# EAGLE design v1 (EAGLE 7.7.0)
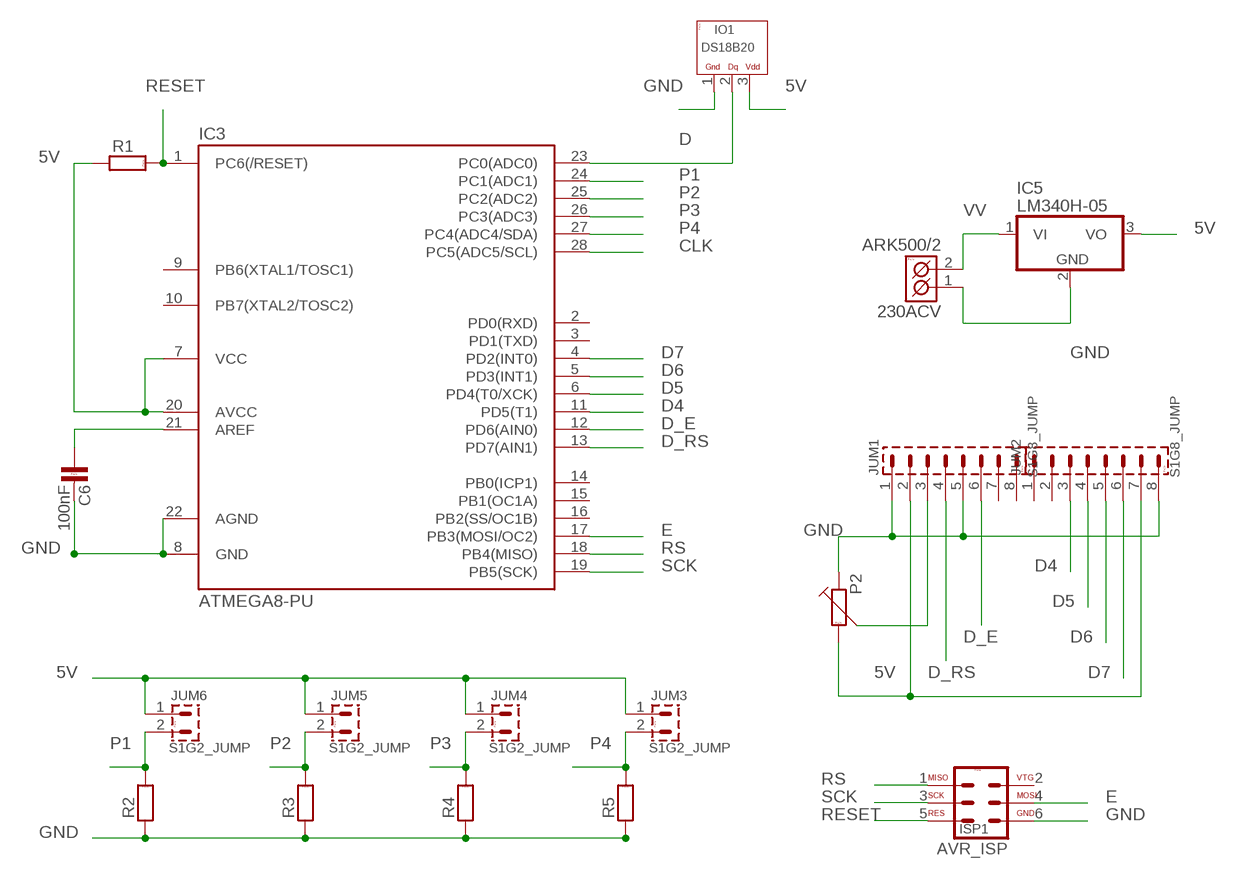
[diagram p0: schematic, sheet 1]

## Parts
230ACV  ARK500/2  [ARK500/2]
C6  100nF  C-KER_2,5  [C-2,5]
IC3  ATMEGA8-PU  [DIL28-3]
IC5  LM340H-05  [TO220H]
IO1  DS18B20  [TO-92]
ISP1  AVR_ISP  [MLW06G]
JUM1  S1G8_JUMP  [S1G8_JUM]
JUM2  S1G8_JUMP  [S1G8_JUM]
JUM3  S1G2_JUMP  [S1G2_JUM]
JUM4  S1G2_JUMP  [S1G2_JUM]
JUM5  S1G2_JUMP  [S1G2_JUM]
JUM6  S1G2_JUMP  [S1G2_JUM]
P2  TRIMRPT6V  [PT6V]
R1  R_7,5  [R-7,5]
R2  R_7,5  [R-7,5]
R3  R_7,5  [R-7,5]
R4  R_7,5  [R-7,5]
R5  R_7,5  [R-7,5]

## Nets
5V: IC3.7(VCC) IC3.20(AVCC) IC5.3(VO) IO1.3(+VCC) JUM1.2 JUM2.7 JUM3.1 JUM4.1 JUM5.1 JUM6.1 P2.2 R1.1
CLK: IC3.28(PC5(ADC5/SCL))
D: IC3.23(PC0(ADC0)) IO1.2(1WIRE)
D4: IC3.11(PD5(T1)) JUM2.3
D5: IC3.6(PD4(T0/XCK)) JUM2.4
D6: IC3.5(PD3(INT1)) JUM2.5
D7: IC3.4(PD2(INT0)) JUM2.6
D_E: IC3.12(PD6(AIN0)) JUM1.6
D_RS: IC3.13(PD7(AIN1)) JUM1.4
E: IC3.17(PB3(MOSI/OC2)) ISP1.4
GND: 230ACV.1(K1) C6.2 IC3.8(GND) IC3.22(AGND) IC5.2(GND) IO1.1(GND) ISP1.6 JUM1.1 JUM1.5 JUM2.8 P2.1 R2.1 R3.1 R4.1 R5.1
N$4: C6.1 IC3.21(AREF)
N$6: JUM1.3 P2.3
P1: IC3.24(PC1(ADC1)) JUM6.2 R2.2
P2: IC3.25(PC2(ADC2)) JUM5.2 R3.2
P3: IC3.26(PC3(ADC3)) JUM4.2 R4.2
P4: IC3.27(PC4(ADC4/SDA)) JUM3.2 R5.2
RESET: IC3.1(PC6(/RESET)) ISP1.5 R1.2
RS: IC3.18(PB4(MISO)) ISP1.1
SCK: IC3.19(PB5(SCK)) ISP1.3
VV: 230ACV.2(K2) IC5.1(VI)
Unconnected: IC3.2(PD0(RXD)) IC3.3(PD1(TXD)) IC3.9(PB6(XTAL1/TOSC1)) IC3.10(PB7(XTAL2/TOSC2)) IC3.14(PB0(ICP1)) IC3.15(PB1(OC1A)) IC3.16(PB2(SS/OC1B)) ISP1.2 JUM1.7 JUM1.8 JUM2.1 JUM2.2

## Library data of the parts
230ACV = #PaJa_konektory:ARK500/2: Svorkovnice - roztec 5mm - dvojita
C6 = #PaJa_31:C-KER: Kondenzator - keramicky
IC3 = atmega8:ATMEGA8-PU
IC5 = linear:LM340?-*: Positive VOLTAGE REGULATOR Source: http://cache.national.com/ds/LM/LM340.pdf
IO1 = #PaJa_31:DS18B20: DS18B20 - teplomer, 1wire (-55 az 125°C)
ISP1 = #PaJa_31:AVR_ISP: AVR ISP konektor (dle standardu)
JUM1 JUM2 = #PaJa_konektory:S1G8_JUMP: Radove konektory - koliky - 8x
JUM3-JUM6 = #PaJa_konektory:S1G2_JUMP: Radove konektory - koliky - 2x
P2 = #PaJa_31:TRIMR: Trimr
R1-R5 = #PaJa_31:R: Rezistor

## Board
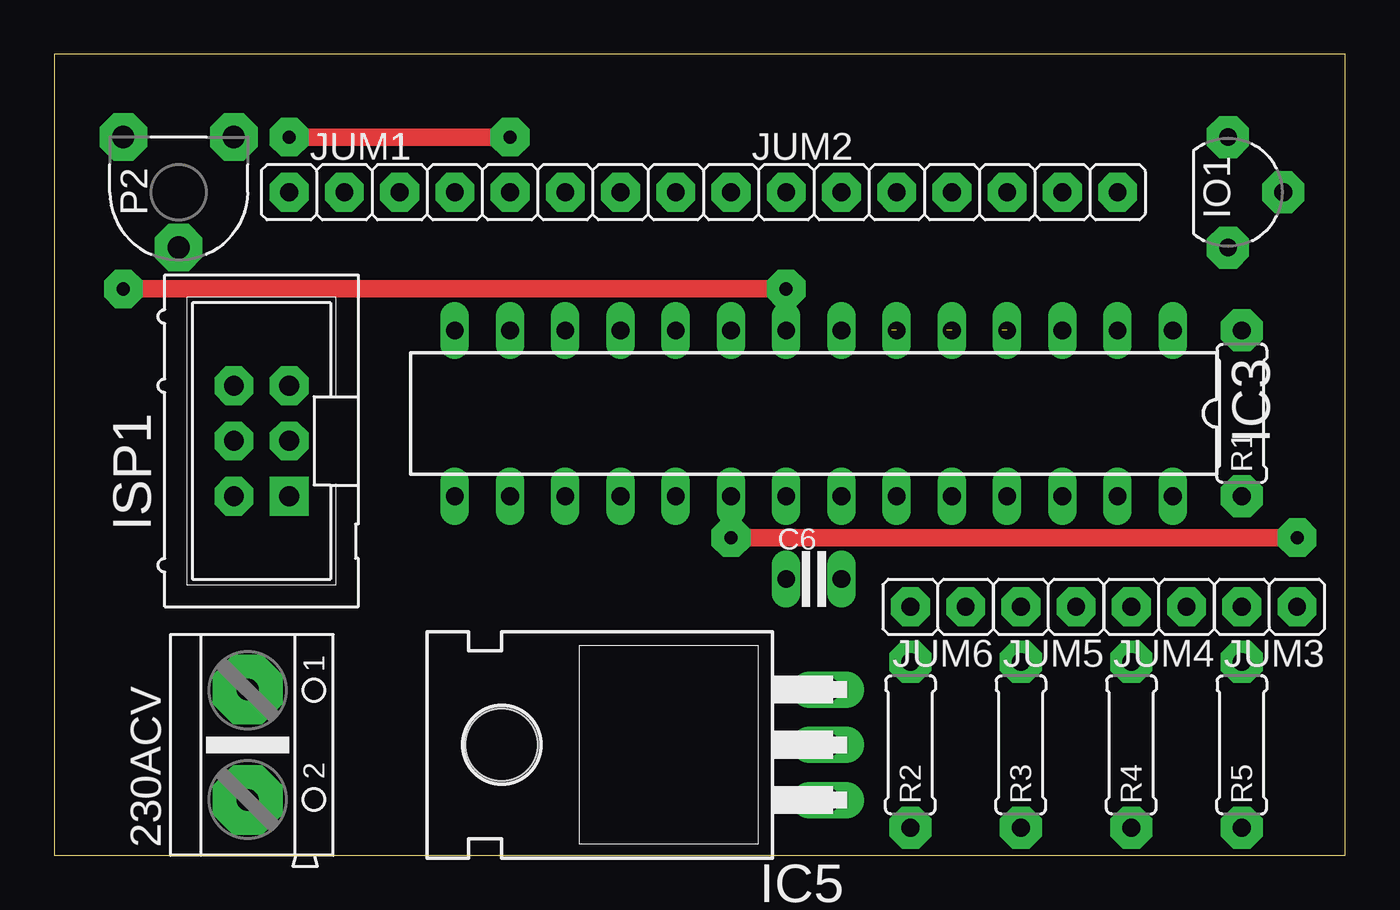
[diagram p1: board, top side]
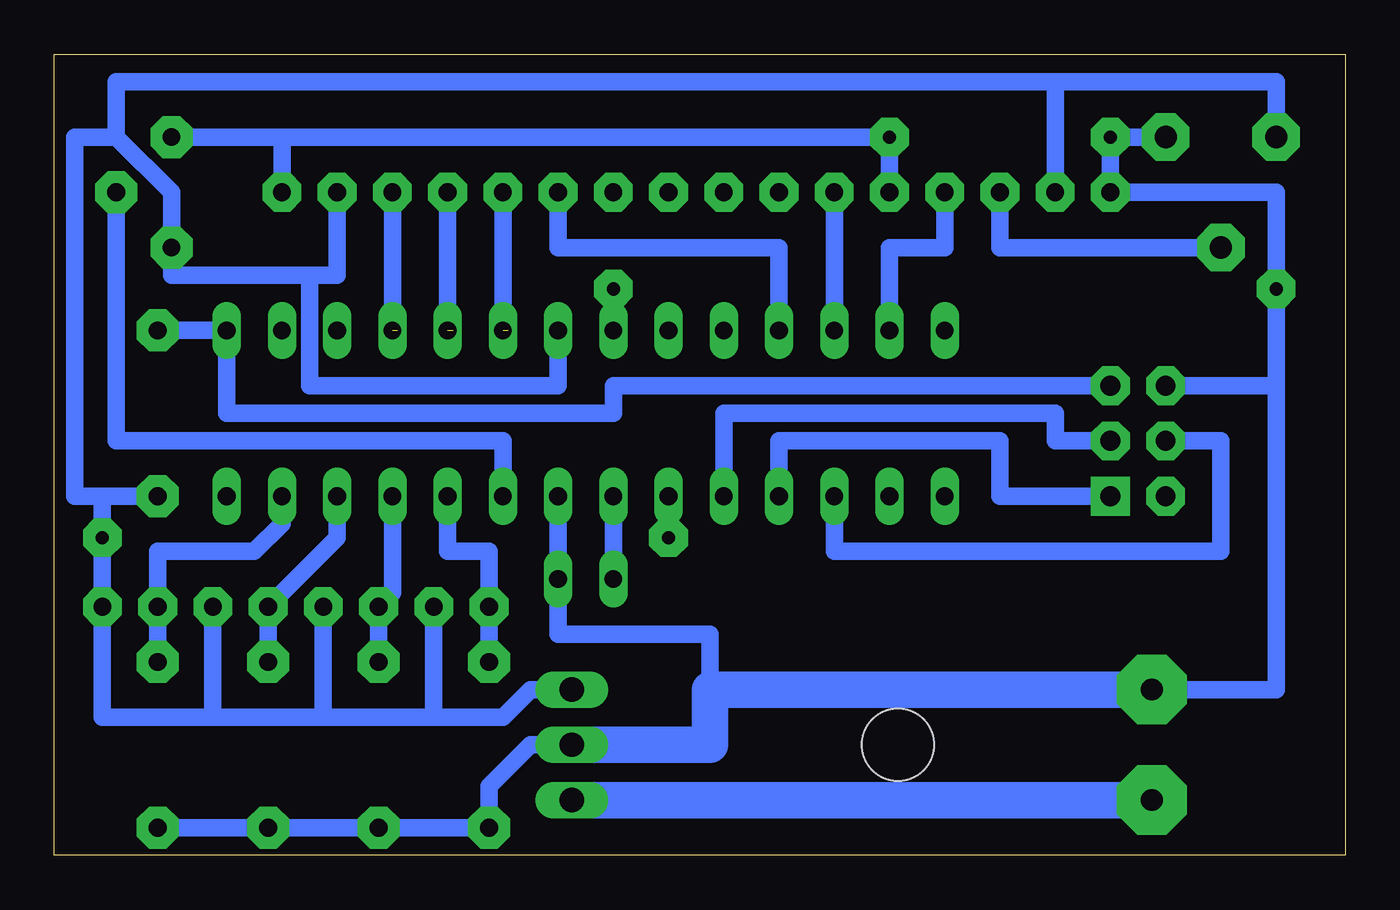
[diagram p2: board, bottom side, seen from below]

Size 59.36 x 36.82 mm. Coordinates in mm from the lower left corner, seen from the top.
Outline: 0,0 59.36,0 59.36,36.82 0,36.82 0,0
Copper layers (1*16): Top 0.035mm / dielectric 1.5mm / Bottom 0.035mm
Design rules "default": minimum track width 10mil, minimum drill 24mil, track to track 8mil, track to pad 8mil, pad to pad 8mil, via to via 8mil, smd to smd 8mil, copper to edge 40mil, drill to drill 8mil, minimum pad ring 10mil, minimum via ring 8mil, stop-mask expansion 4mil, vias tented up to drill 0mil, thermal gap 10mil

### Footprints (pad centres in the part's own frame; a part is rotated, then mirrored left to right if it is on the bottom)
ARK500/2 = drill 1 pad 3.2 octagon: 1 -2.54,0; 2 2.54,0
C-2,5 = drill 0.813 pad 1.27 long: 1 -1.27,0; 2 1.27,0
DIL28-3 = drill 0.813 long: 1 -16.51,-3.81; 2 -13.97,-3.81; 3 -11.43,-3.81; 4 -8.89,-3.81; 5 -6.35,-3.81; 6 -3.81,-3.81; 7 -1.27,-3.81; 8 1.27,-3.81; 9 3.81,-3.81; 10 6.35,-3.81; 11 8.89,-3.81; 12 11.43,-3.81; 13 13.97,-3.81; 14 16.51,-3.81; 15 16.51,3.81; 16 13.97,3.81; 17 11.43,3.81; 18 8.89,3.81; 19 6.35,3.81; 20 3.81,3.81; 21 1.27,3.81; 22 -1.27,3.81; 23 -3.81,3.81; 24 -6.35,3.81; 25 -8.89,3.81; 26 -11.43,3.81; 27 -13.97,3.81; 28 -16.51,3.81
TO220H = drill 1.118 long: 1 -2.54,-10.16; 2 0,-10.16; 3 2.54,-10.16 | hole 3.302: 0,4.826
TO-92 = drill 0.813 pad 1.93 octagon: 1 0,2.54; 2 2.54,0; 3 0,-2.54
MLW06G = drill 0.914 pad 1.778 square: 1 -2.54,-1.27 | drill 0.914 pad 1.778 octagon: 2 -2.54,1.27; 3 0,-1.27; 4 0,1.27; 5 2.54,-1.27; 6 2.54,1.27
S1G8_JUM = drill 0.813 pad 1.778 octagon: 1 -8.89,0; 2 -6.35,0; 3 -3.81,0; 4 -1.27,0; 5 1.27,0; 6 3.81,0; 7 6.35,0; 8 8.89,0
S1G2_JUM = drill 0.813 pad 1.778 octagon: 1 -1.27,0; 2 1.27,0
PT6V = drill 1.016 pad 2.184 octagon: 1 -2.54,-2.54; 2 2.54,-2.54; 3 0,2.54
R-7,5 = drill 0.813 pad 1.93 octagon: 1 -3.81,0; 2 3.81,0

### Placement (x,y rotation side)
230ACV  8.89,5.08 270 top
C6  34.92,12.7 0 top
IC3  34.92,20.32 180 top
IC5  25.4,5.08 90 top
IO1  53.98,30.48 0 top
ISP1  9.53,19.05 90 top
JUM1  19.68,30.48 0 top
JUM2  40.01,30.48 0 top
JUM3  55.88,11.43 180 top
JUM4  50.8,11.43 180 top
JUM5  45.72,11.43 180 top
JUM6  40.64,11.43 180 top
P2  5.71,30.48 180 top
R1  54.61,20.32 90 top
R2  39.37,5.08 90 top
R3  44.45,5.08 90 top
R4  49.53,5.08 90 top
R5  54.61,5.08 90 top

### Tracks (layer width: path | path; a pad name or v marks a point on that pad's centre or on a via)
5V  (via drill 0.6 pad 1.78)
  Top 0.813: v31.11,14.61 v57.15,14.61
  Bottom 0.813: JUM6.1 41.91,6.35 | 41.91,6.35 46.99,6.35 | 46.99,6.35 JUM5.1 | 52.07,6.35 57.15,6.35 JUM3.1 v57.15,14.61 57.15,16.51 | 52.07,6.35 46.99,6.35 | JUM4.1 52.07,6.35 | P2.2 3.17,35.56 13.34,35.56 | 13.34,35.56 JUM1.2 | JUM2.7 46.35,26.67 47.62,26.67 | 47.62,26.67 53.98,26.67 IO1.3 53.98,30.48 56.52,33.02 | 13.34,35.56 56.52,35.56 56.52,33.02 | IC5.3 37.47,7.62 38.73,6.35 41.91,6.35 | IC3.7 36.2,21.59 47.62,21.59 47.62,26.67 | R1.1 57.15,16.51 | 57.15,16.51 58.42,16.51 58.42,33.02 56.52,33.02 | IC3.20 v31.11,14.61
D
  Bottom 0.813: IO1.2 56.52,19.05 38.73,19.05 IC3.23
D4
  Bottom 0.813: IC3.11 26.04,27.94 36.2,27.94 JUM2.3
D5  (1 unrouted)
  Bottom 0.813: IC3.6 JUM2.4
D6  (1 unrouted)
  Bottom 0.813: IC3.5 JUM2.5
D7  (1 unrouted)
  Bottom 0.813: IC3.4 JUM2.6
D_E
  Bottom 0.813: JUM1.6 IC3.12
D_RS
  Bottom 0.813: JUM1.4 18.41,27.94 20.95,27.94 IC3.13
E
  Bottom 0.813: IC3.17 23.5,13.97 5.71,13.97 5.71,19.05 ISP1.4
GND  (via drill 0.6 pad 1.78)
  Top 0.813: v10.79,33.02 v20.95,33.02 | v33.66,26.04 v3.17,26.04
  Bottom 0.813: IC3.22 C6.2 36.2,10.16 29.21,10.16 29.21,7.62 | R5.1 R4.1 R3.1 R2.1 39.37,3.17 37.47,5.08 IC5.2 | ISP1.6 3.17,21.59 | P2.1 v10.79,33.02 JUM1.1 3.17,30.48 v3.17,26.04 3.17,21.59 | 48.9,33.02 v20.95,33.02 JUM1.5 | 48.9,33.02 JUM2.8 | IO1.1 48.9,33.02 | IC3.8 v33.66,26.04 | 3.17,21.59 3.17,7.62 230ACV.1
  Bottom 1.676: 230ACV.1 29.21,7.62 29.21,5.08 IC5.2
N$4
  Bottom 0.813: C6.1 IC3.21
N$6
  Bottom 0.813: P2.3 15.88,27.94 JUM1.3
P1
  Bottom 0.813: R2.2 JUM6.2 39.37,13.97 41.27,13.97 IC3.24
P2
  Bottom 0.813: R3.2 JUM5.2 43.81,12.06 IC3.25
P3
  Bottom 0.813: IC3.26 46.35,14.61 JUM4.2 R4.2
P4
  Bottom 0.813: R5.2 JUM3.2 54.61,13.97 50.16,13.97 48.9,15.24 IC3.27
RESET
  Bottom 0.813: ISP1.5 33.66,21.59 33.66,20.32 51.44,20.32 IC3.1 R1.2
RS
  Bottom 0.813: ISP1.1 15.88,16.51 15.88,19.05 26.04,19.05 IC3.18
SCK
  Bottom 0.813: IC3.19 28.57,20.32 13.34,20.32 13.34,19.05 ISP1.3
VV
  Bottom 1.676: 230ACV.2 IC5.1